# Altium project PowerDistribution.PrjPcb (part 2 of 6)

## Sheet Power Distribution - Power Path.SchDoc: PowerPath Controller
size Letter; Organization: Midnight Sun Solar Rayce Car Team; Address1: University of Waterloo; Address2: 200 University Ave W; Address3: Waterloo, ON, Canada; Address4: N2L 3E9; DocumentNumber: 4; SheetNumber: 4; SheetTotal: 10; Website: www.uwmidsun.com
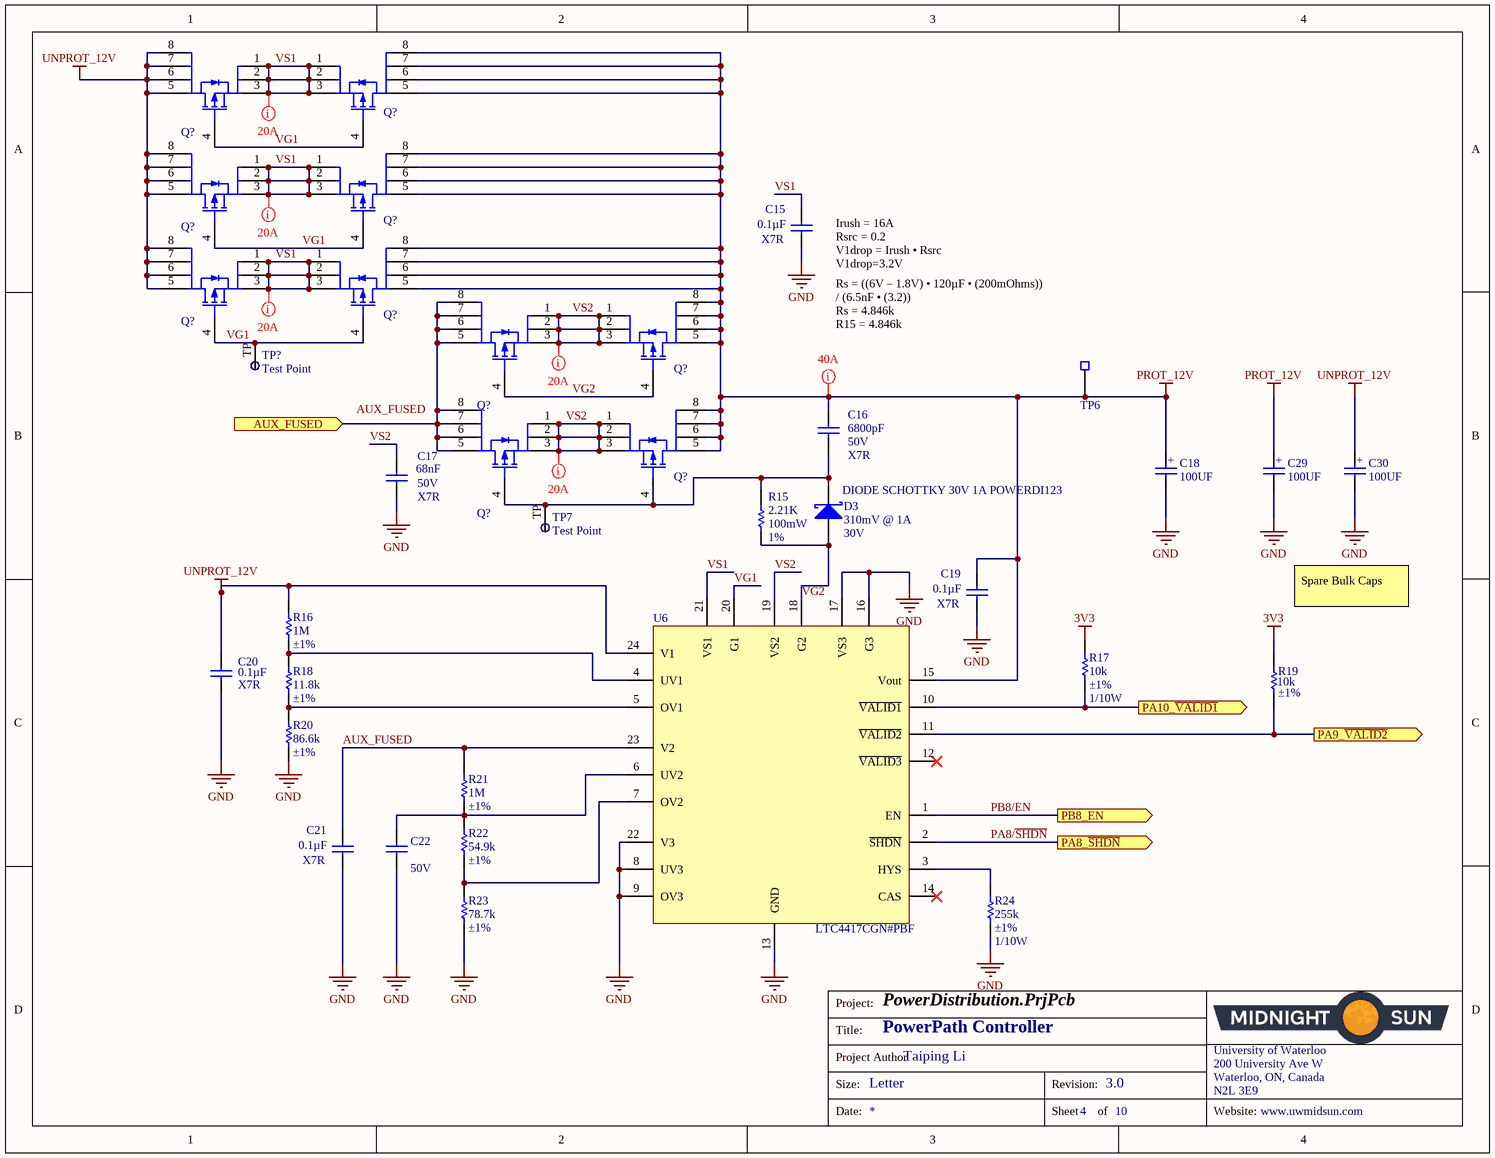
[diagram p3: Power Distribution - Power Path.SchDoc]

### Parts
(Parts that share a designator on the sheet are numbered #1, #2 ... from top to bottom, then left to right.)
C15  Capacitance: 0.1µF  Temperature Coefficient: X7R  [CAP, 0603]  (hidden comment: CAP CER 0.1UF 50V 10% X7R 0603)
C16  Capacitance: 6800pF  Voltage: 50V  Temperature Coefficient: X7R  [CAP, 0603]  (hidden comment: CAP CER 6800pF 50V 10% X7R 0603)
C17  68nF  Voltage Rating: 50V  Dielectric: X7R  [CAP, 0603]
C18  100UF  [CAP ALUM 6.3MM RADIAL SMD]
C19  Capacitance: 0.1µF  Temperature Coefficient: X7R  [CAP, 0603]  (hidden comment: CAP CER 0.1UF 50V 10% X7R 0603)
C20  Capacitance: 0.1µF  Temperature Coefficient: X7R  [CAP, 0603]  (hidden comment: CAP CER 0.1UF 50V 10% X7R 0603)
C21  Capacitance: 0.1µF  Temperature Coefficient: X7R  [CAP, 0603]  (hidden comment: CAP CER 0.1UF 50V 10% X7R 0603)
C22  Voltage - Rated: 50V  [CAP, 0603]  (hidden comment: CAP CER 0.022UF 50V 10% X7R 0603)
C29  100UF  [CAP ALUM 6.3MM RADIAL SMD]  (no BOM)
C30  100UF  [CAP ALUM 6.3MM RADIAL SMD]  (no BOM)
D3  DIODE SCHOTTKY 30V 1A POWERDI123  Voltage - Forward (Vf) (Max) @ If: 310mV @ 1A  Voltage - DC Reverse (Vr) (Max): 30V  [DIODE SCHOTTKY 30V 1A POWERDI123]
Q?#1  MOSFET P-CH PWR56 40V 4.9 MOHM  [PMOS PWR56 40V 4.9 MOHM]  (value not drawn)
Q?#2  MOSFET P-CH PWR56 40V 4.9 MOHM  [PMOS PWR56 40V 4.9 MOHM]  (value not drawn)
Q?#3  MOSFET P-CH PWR56 40V 4.9 MOHM  [PMOS PWR56 40V 4.9 MOHM]  (value not drawn)
Q?#4  MOSFET P-CH PWR56 40V 4.9 MOHM  [PMOS PWR56 40V 4.9 MOHM]  (value not drawn)
Q?#5  MOSFET P-CH PWR56 40V 4.9 MOHM  [PMOS PWR56 40V 4.9 MOHM]  (value not drawn)
Q?#6  MOSFET P-CH PWR56 40V 4.9 MOHM  [PMOS PWR56 40V 4.9 MOHM]  (value not drawn)
Q?#7  MOSFET P-CH PWR56 40V 4.9 MOHM  [PMOS PWR56 40V 4.9 MOHM]  (value not drawn)
Q?#8  MOSFET P-CH PWR56 40V 4.9 MOHM  [PMOS PWR56 40V 4.9 MOHM]  (value not drawn)
Q?#9  MOSFET P-CH PWR56 40V 4.9 MOHM  [PMOS PWR56 40V 4.9 MOHM]  (value not drawn)
Q?#10  MOSFET P-CH PWR56 40V 4.9 MOHM  [PMOS PWR56 40V 4.9 MOHM]  (value not drawn)
R15  2.21K  Tolerance: 1%  Max Power Dissipation: 100mW  [RES, 0603]
R16  Resistance (Ohms): 1M  Tolerance: ±1%  [RES, 0603]  (hidden comment: RES 1M OHM 1% 1/10W 0603)
R17  Resistance: 10k  Tolerance: ±1%  Power: 1/10W  [RES, 0603]  (hidden comment: RES 10K OHM 1% 1/10W 0603)
R18  Resistance (Ohms): 11.8k  Tolerance: ±1%  [RES, 0603]  (hidden comment: RES 11.8K OHM 1% 1/10W 0603)
R19  Resistance: 10k  Tolerance: ±1%  [RES, 0603]  (hidden comment: RES 10K OHM 1% 1/10W 0603)
R20  Resistance (Ohms): 86.6k  Tolerance: ±1%  [RES, 0603]  (hidden comment: RES 86.6K OHM 1% 1/10W 0603)
R21  Resistance (Ohms): 1M  Tolerance: ±1%  [RES, 0603]  (hidden comment: RES 1M OHM 1% 1/10W 0603)
R22  Resistance (Ohms): 54.9k  Tolerance: ±1%  [RES, 0603]  (hidden comment: RES 54.9K OHM 1% 1/10W 0603)
R23  Resistance (Ohms): 78.7k  Tolerance: ±1%  [RES, 0603]  (hidden comment: RES 78.7K OHM 1% 1/10W 0603)
R24  Resistance (Ohms): 255k  Tolerance: ±1%  Power (Watts): 1/10W  [RES, 0603]  (hidden comment: RES 255K OHM 1% 1/10W 0603)
TP6  Test Point 0603 SMD  [TEST POINT 0603 SMD]  (value not drawn)
TP7  Test Point  [Test Point]  (no BOM)
TP?#1  Test Point  [Test Point]  (no BOM)
U6  Manufacturer Part Number 1: LTC4417CGN#PBF  [IC OR CTRLR SRC SELECT 24SSOP]  (hidden comment: IC OR CONTROLLER SOURCE SELECT 24SSOP)

### Ports
AUX_FUSED (in), PA8_~{SHDN} (out), PA9_~{VALID2} (out), PA10_~{VALID1} (out), PB8_EN (out)

### Nets
3V3: R17.1 R19.1
GND: C15.2 C17.2 C18.2 C19.2 C20.2 C21.2 C22.2 C29.2 C30.2 R20.2 R23.2 R24.2 U6.8(UV3) U6.9(OV3) U6.13(GND) U6.16(G3) U6.17(VS3) U6.22(V3)
PROT_12V: C16.1 C18.1 C19.1 C29.1 Q?#2.5(D) Q?#2.6(D) Q?#2.7(D) Q?#2.8(D) Q?#4.5(D) Q?#4.6(D) Q?#4.7(D) Q?#4.8(D) Q?#6.5(D) Q?#6.6(D) Q?#6.7(D) Q?#6.8(D) Q?#8.5(D) Q?#8.6(D) Q?#8.7(D) Q?#8.8(D) Q?#10.5(D) Q?#10.6(D) Q?#10.7(D) Q?#10.8(D) TP6.1 U6.15(Vout)
UNPROT_12V: C20.1 C30.1 Q?#1.5(D) Q?#1.6(D) Q?#1.7(D) Q?#1.8(D) Q?#3.5(D) Q?#3.6(D) Q?#3.7(D) Q?#3.8(D) Q?#5.5(D) Q?#5.6(D) Q?#5.7(D) Q?#5.8(D) R16.1 U6.24(V1)
AUX_FUSED: C21.1 R21.1 U6.23(V2)
PA8/~{SHDN}: U6.2(~{SHDN}) ; port PA8_~{SHDN}
PB8/EN: U6.1(EN) ; port PB8_EN
VG1: Q?#1.4(G) Q?#2.4(G) Q?#3.4(G) Q?#4.4(G) Q?#5.4(G) Q?#6.4(G) TP?#1.TP U6.20(G1)
VG2: D3.1(A) Q?#7.4(G) Q?#8.4(G) R15.2 U6.18(G2)
VS1: C15.1 Q?#1.1(S) Q?#1.2(S) Q?#1.3(S) Q?#2.1(S) Q?#2.2(S) Q?#2.3(S) Q?#3.1(S) Q?#3.2(S) Q?#3.3(S) Q?#4.1(S) Q?#4.2(S) Q?#4.3(S) Q?#5.1(S) Q?#5.2(S) Q?#5.3(S) Q?#6.1(S) Q?#6.2(S) Q?#6.3(S) U6.21(VS1)
VS2: C17.1 Q?#7.1(S) Q?#7.2(S) Q?#7.3(S) Q?#8.1(S) Q?#8.2(S) Q?#8.3(S) Q?#9.1(S) Q?#9.2(S) Q?#9.3(S) Q?#10.1(S) Q?#10.2(S) Q?#10.3(S) U6.19(VS2)
NetC16_2: C16.2 D3.2(K) Q?#9.4(G) Q?#10.4(G) R15.1 TP7.TP
NetC22_1: C22.1 R21.2 R22.1 U6.6(UV2)
NetQ?#7_5: Q?#7.5(D) Q?#7.6(D) Q?#7.7(D) Q?#7.8(D) Q?#9.5(D) Q?#9.6(D) Q?#9.7(D) Q?#9.8(D) ; port AUX_FUSED
NetR16_2: R16.2 R18.1 U6.4(UV1)
NetR17_2: R17.2 U6.10(~{VALID1}) ; port PA10_~{VALID1}
NetR18_2: R18.2 R20.1 U6.5(OV1)
NetR19_2: R19.2 U6.11(~{VALID2}) ; port PA9_~{VALID2}
NetR22_2: R22.2 R23.1 U6.7(OV2)
NetR24_1: R24.1 U6.3(HYS)

Not connected (* = marked no-connect by the designer): U6 12(~{VALID3})* 14(CAS)*

### Layout directives
net class HighCurrent; rule Power Plane Connect Style [Style - Direct Connect]; rule Polygon Connect Style [Style - Direct Connect]: PROT_12V, VS1, VS2

### Notes on the sheet
- (near C15) Irush = 16A
  Rsrc = 0.2
  V1drop = Irush • Rsrc V1drop=3.2V
- Rs = ((6V – 1.8V) • 120µF • (200mOhms)) / (6.5nF • (3.2))
  Rs = 4.846k
  R15 = 4.846k
- Spare Bulk Caps
- Labels drawn without touching a wire or pin: AUX_FUSED
- Project:
- Title:
- Size:
- Project Author
- Letter
- Revision:
- University of Waterloo
- 200 University Ave W
- Waterloo, ON, Canada
- N2L 3E9
- Date:
- Sheet
- of
- Website:
- (in symbol CAP ALUM 100UF 20% 35V SMD) +

### Library data of the parts
C15 C19-C21 = CAP CER 0.1UF 50V 10% X7R 0603: 0.10µF ±10% 50V Ceramic Capacitor X7R 0603 (1608 Metric); Manufacturer 1: AVX Corporation; Manufacturer Part Number 1: 06035C104KAT2A; Supplier 1: Digi-Key; Supplier Part Number 1: 478-5052-1-ND; Packaging: Cut Tape (CT); Part Status: Active; Operating Temperature: -55°C ~ 125°C; Ratings: -; Mounting Type: Surface Mount, MLCC; Package / Case: 0603 (1608 Metric); Size / Dimension: 0.063" L x 0.032" W (1.60mm x 0.81mm); Height - Seated (Max): -; Thickness (Max): 0.035" (0.90mm); Lead Spacing: -; Lead Style: -; ComponentLink1URL: http://datasheets.avx.com/X7RDielectric.pdf; ComponentLink1Description: http://datasheets.avx.com/X7RDielectric.pdf; Tolerance: ±10%; Voltage: 50V
C16 = CAP CER 6800pF 50V 10% X7R 0603: 6800pF ±10% 50V Ceramic Capacitor X7R 0603 (1608 Metric); Manufacturer 1: Samsung Electro-Mechanics America, Inc.; Manufacturer Part Number 1: CL10B682KB8SFNC; Supplier 1: Digi-Key; Supplier Part Number 1: 1276-2103-1-ND; Packaging: Cut Tape (CT); Part Status: Active; Operating Temperature: -55°C ~ 125°C; Ratings: -; Mounting Type: Surface Mount, MLCC; Package / Case: 0603 (1608 Metric); Size / Dimension: 0.063" L x 0.031" W (1.60mm x 0.80mm); Height - Seated (Max): -; Thickness (Max): 0.035" (0.90mm); Lead Spacing: -; Lead Style: -; ComponentLink1URL: http://www.samsungsem.com/kr/support/product-search/mlcc/CL10B682KB8SFNC.jsp; ComponentLink1Description: http://www.samsungsem.com/kr/support/product-search/mlcc/CL10B682KB8SFNC.jsp; Tolerance: ±10%
C17 = CAP CER 0.068UF 10% 50V X7R 0603: 0.068µF 50V Ceramic Capacitor X7R 0603 (1608 Metric) 0.063" L x 0.032" W (1.60mm x 0.80mm); Manufacturer: Murata; Manufacturer Part Number: GCM188R71H683KA57D; Tolerance: 10%; Supplier 1: Digi-Key; Stock 1: 40000; Pricing 1: 1=0.16, 10=0.116, 100=0.0547, 500=0.03832, 1000=0.03172 (USD); Mount: Surface Mount; Case/Package: 0603; Case Code (Metric): 1608; Case Code (Imperial): 0603; Min Operating Temperature: -55°C; Max Operating Temperature: 125°C; Packaging: Tape and Reel; Capacitance: 68nF; Package Quantity: 4000; Voltage Rating (DC): 50V; Termination: SMD/SMT; Length: 1.6mm; Height: 0.8mm; Width: 0.031inch; Thickness: 0.035inch; Depth: 0.8mm; Radiation Hardening: No; ComponentLink1URL: https://datasheet.ciiva.com/29542/s0717e-29542427.pdf; ComponentLink1Description: https://datasheet.ciiva.com/29542/s0717e-29542427.pdf; ComponentLink2URL: https://datasheet.ciiva.com/29542/s0717e-29542428.pdf; ComponentLink2Description: https://datasheet.ciiva.com/29542/s0717e-29542428.pdf; ComponentLink3URL: https://datasheet.ciiva.com/29542/s0717e-29542429.pdf; ComponentLink3Description: https://datasheet.ciiva.com/29542/s0717e-29542429.pdf; Supplier Part Number 1: 490-8027-1-ND
C18 C29 C30 = CAP ALUM 100UF 20% 35V SMD: 100µF 35V Aluminum Electrolytic Capacitors Radial, Can - SMD 2000 Hrs @ 85°C; Manufacturer 1: Panasonic; Manufacturer Part Number 1: EEE-1VA101XP; Description 1: Cap Aluminum Lytic 100uF 35V 20% (6.3 X 7.7mm) SMD 132mA 2000h 85C Automotive T/R; Tolerance: 20%; Ripple Current: 132mA; Polarity: Polar; Life (Hours): 2000Hour; Leakage Current: 3uA; Supplier 1: Digi-Key; Supplier Part Number 1: PCE3951CT-ND; Stock 1: 170823; Pricing 1: 1=0.44, 10=0.304, 100=0.1822 (USD); Mount: Surface Mount,PCB; Case/Package: Radial; Number of Pins: 8; Contact Plating: Tin; Min Operating Temperature: -40°C; Max Operating Temperature: 85°C; Capacitance: 100uF; Voltage Rating: 35V; Packaging: Tape and Reel; Package Quantity: 900; Ripple Current (AC): 132mA; Voltage Rating (DC): 35V; Termination: SMD/SMT; Voltage: 35V; Diameter: 6.3mm; Length: 8mm; Height: 7.7mm; Height - Seated (Max): 0.303inch; Radiation Hardening: No; REACH SVHC: No SVHC; Lead Free: Lead Free; ComponentLink1URL: https://datasheet.ciiva.com/46378/aba0000ce2-46378341.pdf; ComponentLink1Description: https://datasheet.ciiva.com/46378/aba0000ce2-46378341.pdf; ComponentLink2URL: https://datasheet.ciiva.com/17535/aba0000ce2-17535510.pdf; ComponentLink2Description: https://datasheet.ciiva.com/17535/aba0000ce2-17535510.pdf; ComponentLink3URL: https://datasheet.ciiva.com/30170/11aba0000ce2-30170103.pdf; ComponentLink3Description: https://datasheet.ciiva.com/30170/11aba0000ce2-30170103.pdf; ComponentLink4URL: https://datasheet.ciiva.com/31414/aba0000ce2-31414696.pdf; ComponentLink4Description: https://datasheet.ciiva.com/31414/aba0000ce2-31414696.pdf; ComponentLink5URL: https://datasheet.ciiva.com/24068/aba0000ce2-40801-24068089.pdf; ComponentLink5Description: https://datasheet.ciiva.com/24068/aba0000ce2-40801-24068089.pdf; ComponentLink6URL: https://datasheet.ciiva.com/14591/70255710-14591771.pdf; ComponentLink6Description: https://datasheet.ciiva.com/14591/70255710-14591771.pdf; ComponentLink7URL: https://datasheet.ciiva.com/14600/70255710-14600731.pdf; ComponentLink7Description: https://datasheet.ciiva.com/14600/70255710-14600731.pdf; ComponentLink8URL: https://datasheet.ciiva.com/46374/aba0000ce2-46374427.pdf; ComponentLink8Description: https://datasheet.ciiva.com/46374/aba0000ce2-46374427.pdf; ComponentLink9URL: https://datasheet.ciiva.com/11673/aba0000ce2-11673887.pdf; ComponentLink9Description: https://datasheet.ciiva.com/11673/aba0000ce2-11673887.pdf
C22 = CAP CER 0.022UF 50V 10% X7R 0603: 0.022µF ±10% 50V Ceramic Capacitor X7R 0603 (1608 Metric); Manufacturer 1: Murata Electronics North America; Manufacturer Part Number 1: GRM188R71H223KA01D; Description 1: CAP CER 0.022UF 50V X7R 0603; Supplier 1: Digi-Key; Supplier Part Number 1: 490-1517-1-ND; RoHS: RoHS Compliant; Category: Capacitors; Stock 1: 612330; Pricing 1: 1=0.15, 10=0.111, 100=0.0499, 500=0.03564, 1000=0.02801 (CAD); Packaging: Cut Tape (CT); Part Status: Active; Tolerance: ±10%; Temperature Coefficient: X7R; Operating Temperature: -55°C ~ 125°C; Features: -; Ratings: -; Applications: General Purpose; Mounting Type: Surface Mount, MLCC; Package / Case: 0603 (1608 Metric); Size / Dimension: 0.063" L x 0.032" W (1.60mm x 0.80mm); Height - Seated (Max): -; Thickness (Max): 0.035" (0.90mm); Lead Spacing: -; Lead Style: -; ComponentLink1URL: http://search.murata.co.jp/Ceramy/image/img/A01X/G101/ENG/GRM188R71H223KA01-01.pdf; ComponentLink1Description: http://search.murata.co.jp/Ceramy/image/img/A01X/G101/ENG/GRM188R71H223KA01-01.pdf
D3 = DIODE SCHOTTKY 30V 1A POWERDI123: Diode Schottky 30V 1A Surface Mount PowerDI™ 123; Manufacturer: Diodes Incorporated; Manufacturer Part Number: DFLS130L-7; Speed: Fast Recovery =< 500ns, > 200mA (Io); Current - Reverse Leakage @ Vr: 1mA @ 30V; Capacitance @ Vr, F: 76pF @ 10V, 1MHz; Supplier 1: Digi-Key; RoHS: RoHS Compliant; Category: Discrete Semiconductor Products; Stock 1: 68200; Packaging: Cut Tape (CT); Part Status: Active; Diode Type: Schottky; Mounting Type: Surface Mount; Package / Case: POWERDI®123; Supplier Device Package: PowerDI™ 123; Operating Temperature - Junction: -40°C ~ 125°C; ComponentLink1URL: https://www.diodes.com/assets/Datasheets/ds30492.pdf; ComponentLink1Description: https://www.diodes.com/assets/Datasheets/ds30492.pdf; Supplier Part Number 1: DFLS130LDICT-ND; Pricing 1: 1=0.7, 10=0.599, 100=0.447, 500=0.35126, 1000=0.27142 (CAD); Current - Average Rectified (Io): 1A
Q?#1-Q?#10 = MOSFET P-CH PWR56 40V 4.9 MOHM: P-Channel 16V 2.5A (Ta) 650mW (Ta) Surface Mount X2-DFN2015-3; Current - Continuous Drain (Id) @ 25°C: 80A (Tc); Drive Voltage (Max Rds On,  Min Rds On): 4.5V, 10V; Vgs(th) (Max) @ Id: 3V @ 250µA; Gate Charge (Qg) (Max) @ Vgs: 107nC @ 10V; Input Capacitance (Ciss) (Max) @ Vds: 4840pF @ 20V; Power Dissipation (Max): 214W (Tj); Rds On (Max) @ Id, Vgs: 4.9mOhm @ 80A, 10V; Packaging: Cut Tape (CT); Part Status: Active; FET Type: P-Channel; Technology: MOSFET (Metal Oxide); Drain to Source Voltage (Vdss): 40V; Vgs (Max): ±16V; FET Feature: -; Operating Temperature: -55°C ~ 175°C (TJ); Mounting Type: Surface Mount; Supplier Device Package: FDWS9508L-F085OSCT-ND; Package / Case: 8-PowerTDFN; ComponentLink1URL: https://www.onsemi.com/pub/Collateral/FDWS9508L-F085-D.PDF; ComponentLink1Description: https://www.onsemi.com/pub/Collateral/FDWS9508L-F085-D.PDF; Supplier 1: Digi-Key; Supplier Part Number 1: FDWS9508L-F085OSCT-ND
R15 = RES 2.21K OHM 1% 1/10W 0603: 2.21 kOhms ±1% 0.1W, 1/10W Chip Resistor 0603 (1608 Metric) Automotive AEC-Q200, Moisture Resistant Thick Film; Manufacturer: Yageo; Manufacturer Part Number: AC0603FR-072K21L; Voltage Rating: 50V; Resistance: 2.21kR; Temperature Coefficient: 100ppm/°C; Working Voltage: 75V; Supplier 1: Digi-Key; Stock 1: 11020; Pricing 1: 1=0.1, 10=0.029, 100=0.0117, 1000=0.00527, 2500=0.00458 (USD); Case/Package: 0603; Weight: 7.1E-05oz; Case Code (Imperial): 0603; Case Code (Metric): 1608; Min Operating Temperature: -55°C; Max Operating Temperature: 155°C; Power Rating: 100mW; Packaging: Tape and Reel; Composition: Thick Film; Termination: SMD/SMT; Number of Terminations: 2; Length: 0.063inch; Height: 0.022inch; Width: 0.8mm; Lead Free: Lead Free; ComponentLink1URL: https://datasheet.ciiva.com/12576/pyu-ac-51-rohs-l-2-12576458.pdf; ComponentLink1Description: https://datasheet.ciiva.com/12576/pyu-ac-51-rohs-l-2-12576458.pdf; Supplier Part Number 1: YAG3586CT-ND
R16 R21 = RES 1M OHM 1% 1/10W 0603: 1M Ohm ±1% 0.1W, 1/10W Chip Resistor 0603 (1608 Metric) Moisture Resistant Thick Film; Manufacturer 1: Yageo; Manufacturer Part Number 1: RC0603FR-071ML; Description 1: RES SMD 1M OHM 1% 1/10W 0603; Temperature Coefficient: ±100ppm/°C; Supplier 1: Digi-Key; Supplier Part Number 1: 311-1.00MHRCT-ND; RoHS: RoHS Compliant; Category: Resistors; Stock 1: 2336711; Pricing 1: 1=0.16, 10=0.022, 100=0.0089, 1000=0.00402, 2500=0.00349 (CAD); Packaging: Cut Tape (CT); Part Status: Active; Composition: Thick Film; Features: Moisture Resistant; Operating Temperature: -55°C ~ 155°C; Package / Case: 0603 (1608 Metric); Supplier Device Package: 0603; Size / Dimension: 0.063" L x 0.031" W (1.60mm x 0.80mm); Height - Seated (Max): 0.022" (0.55mm); Failure Rate: -; ComponentLink1URL: http://www.yageo.com/documents/recent/PYu-RC_Group_51_RoHS_L_7.pdf; ComponentLink1Description: http://www.yageo.com/documents/recent/PYu-RC_Group_51_RoHS_L_7.pdf
R17 R19 = RES 10K OHM 1% 1/10W 0603: RES SMD 10K OHM 1% 1/10W 0603; Manufacturer 1: Yageo; Manufacturer Part Number 1: RC0603FR-0710KL; Temperature Coefficient: ±100ppm/°C; Supplier 1: Digi-Key; Supplier Part Number 1: 311-10.0KHRCT-ND; Packaging: Cut Tape (CT); Part Status: Active; Composition: Thick Film; Operating Temperature: -55°C ~ 155°C; Package / Case: 0603 (1608 Metric); Supplier Device Package: 0603; Size / Dimension: 0.063" L x 0.031" W (1.60mm x 0.80mm); Height - Seated (Max): 0.022" (0.55mm); Failure Rate: -; ComponentLink1URL: http://www.yageo.com/documents/recent/PYu-RC_Group_51_RoHS_L_7.pdf; ComponentLink1Description: http://www.yageo.com/documents/recent/PYu-RC_Group_51_RoHS_L_7.pdf
R18 = RES 11.8K OHM 1% 1/10W 0603: 11.8k Ohm ±1% 0.1W, 1/10W Chip Resistor 0603 (1608 Metric) Moisture Resistant Thick Film; Manufacturer: Yageo; Manufacturer Part Number: RC0603FR-0711K8L; Temperature Coefficient: ±100ppm/°C; Supplier 1: Digi-Key; RoHS: RoHS Compliant; Category: Resistors; Stock 1: 203280; Pricing 1: 1=0.16, 10=0.022, 100=0.0089, 1000=0.00402, 2500=0.00349 (CAD); Packaging: Cut Tape (CT); Part Status: Active; Power (Watts): 1/10W; Composition: Thick Film; Features: Moisture Resistant; Operating Temperature: -55°C ~ 155°C; Package / Case: 0603 (1608 Metric); Supplier Device Package: 0603; Size / Dimension: 0.063" L x 0.031" W (1.60mm x 0.80mm); Height - Seated (Max): 0.022" (0.55mm); Failure Rate: -; ComponentLink1URL: http://www.yageo.com/documents/recent/PYu-RC_Group_51_RoHS_L_7.pdf; ComponentLink1Description: http://www.yageo.com/documents/recent/PYu-RC_Group_51_RoHS_L_7.pdf; Supplier Part Number 1: 311-11.8KHRCT-ND
R20 = RES 86.6K OHM 1% 1/10W 0603: 86.6k Ohm ±1% 0.1W, 1/10W Chip Resistor 0603 (1608 Metric) Automotive AEC-Q200 Thick Film; Manufacturer: Panasonic Electronic Components; Manufacturer Part Number: ERJ-3EKF8662V; Temperature Coefficient: ±100ppm/°C; Supplier 1: Digi-Key; RoHS: RoHS Compliant; Category: Resistors; Stock 1: 64161; Pricing 1: 1=0.16, 10=0.031, 100=0.0127, 1000=0.00567, 2500=0.00492 (CAD); Packaging: Cut Tape (CT); Part Status: Active; Power (Watts): 1/10W; Composition: Thick Film; Features: Automotive AEC-Q200; Operating Temperature: -55°C ~ 155°C; Package / Case: 0603 (1608 Metric); Supplier Device Package: 0603; Size / Dimension: 0.063" L x 0.031" W (1.60mm x 0.80mm); Height - Seated (Max): 0.022" (0.55mm); Failure Rate: -; ComponentLink1URL: https://industrial.panasonic.com/cdbs/www-data/pdf/RDA0000/AOA0000C298.pdf; ComponentLink1Description: https://industrial.panasonic.com/cdbs/www-data/pdf/RDA0000/AOA0000C298.pdf; Supplier Part Number 1: P86.6KHCT-ND
R22 = RES 54.9K OHM 1% 1/10W 0603: 54.9k Ohm ±1% 0.1W, 1/10W Chip Resistor 0603 (1608 Metric) Automotive AEC-Q200 Thick Film; Manufacturer: Panasonic Electronic Components; Manufacturer Part Number: ERJ-3EKF5492V; Temperature Coefficient: ±100ppm/°C; Supplier 1: Digi-Key; RoHS: RoHS Compliant; Category: Resistors; Stock 1: 74038; Pricing 1: 1=0.16, 10=0.031, 100=0.0127, 1000=0.00567, 2500=0.00492 (CAD); Packaging: Cut Tape (CT); Part Status: Active; Power (Watts): 1/10W; Composition: Thick Film; Features: Automotive AEC-Q200; Operating Temperature: -55°C ~ 155°C; Package / Case: 0603 (1608 Metric); Supplier Device Package: 0603; Size / Dimension: 0.063" L x 0.031" W (1.60mm x 0.80mm); Height - Seated (Max): 0.022" (0.55mm); Failure Rate: -; ComponentLink1URL: https://industrial.panasonic.com/cdbs/www-data/pdf/RDA0000/AOA0000C298.pdf; ComponentLink1Description: https://industrial.panasonic.com/cdbs/www-data/pdf/RDA0000/AOA0000C298.pdf; Supplier Part Number 1: P54.9KHCT-ND
R23 = RES 78.7K OHM 1% 1/10W 0603: 78.7k Ohm ±1% 0.1W, 1/10W Chip Resistor 0603 (1608 Metric) Automotive AEC-Q200 Thick Film; Manufacturer: Panasonic Electronic Components; Manufacturer Part Number: ERJ-3EKF7872V; Temperature Coefficient: ±100ppm/°C; Supplier 1: Digi-Key; RoHS: RoHS Compliant; Category: Resistors; Packaging: Cut Tape (CT); Part Status: Active; Power (Watts): 1/10W; Composition: Thick Film; Features: Automotive AEC-Q200; Operating Temperature: -55°C ~ 155°C; Package / Case: 0603 (1608 Metric); Supplier Device Package: 0603; Size / Dimension: 0.063" L x 0.031" W (1.60mm x 0.80mm); Height - Seated (Max): 0.022" (0.55mm); Failure Rate: -; ComponentLink1URL: https://industrial.panasonic.com/cdbs/www-data/pdf/RDA0000/AOA0000C298.pdf; ComponentLink1Description: https://industrial.panasonic.com/cdbs/www-data/pdf/RDA0000/AOA0000C298.pdf; Supplier Part Number 1: P78.7KHCT-ND
R24 = RES 255K OHM 1% 1/10W 0603: 255k Ohm ±1% 0.1W, 1/10W Chip Resistor 0603 (1608 Metric) Moisture Resistant Thick Film; Manufacturer 1: Yageo; Manufacturer Part Number 1: RC0603FR-07255KL; Description 1: RES SMD 255K OHM 1% 1/10W 0603; Temperature Coefficient: ±100ppm/°C; Supplier 1: Digi-Key; Supplier Part Number 1: 311-255KHRCT-ND; RoHS: RoHS Compliant; Category: Resistors; Stock 1: 106564; Pricing 1: 1=0.16, 10=0.022, 100=0.0089, 1000=0.00402, 2500=0.00349 (CAD); Packaging: Cut Tape (CT); Part Status: Active; Composition: Thick Film; Features: Moisture Resistant; Operating Temperature: -55°C ~ 155°C; Package / Case: 0603 (1608 Metric); Supplier Device Package: 0603; Size / Dimension: 0.063" L x 0.031" W (1.60mm x 0.80mm); Height - Seated (Max): 0.022" (0.55mm); Failure Rate: -; ComponentLink1URL: http://www.yageo.com/documents/recent/PYu-RC_Group_51_RoHS_L_7.pdf; ComponentLink1Description: http://www.yageo.com/documents/recent/PYu-RC_Group_51_RoHS_L_7.pdf
TP6 = Test Point 0603 SMD: Manufacturer 1: TE Connectivity; Manufacturer Part Number 1: 1625854-3; Description 1: Thick Film Resistors - SMD 2000; Resistance: 0mR; Supplier 1: Digi-Key; Supplier Part Number 1: A106145CT-ND; Stock 1: 212628; Pricing 1: 1=0.22, 10=0.211, 25=0.18, 50=0.1574, 100=0.1462, 250=0.12932, 500=0.12368, 1000=0.1012 (USD); Mount: Surface Mount; Case/Package: 0603; Colour: Natural; Case Code (Imperial): 0603; Case Code (Metric): 1608; Min Operating Temperature: -55°C; Max Operating Temperature: 125°C; Packaging: Tape and Reel; Termination: SMD/SMT; Package Quantity: 2000; Military Standard: Not; Length: 1.6mm; Height: 1.15mm; Width: 0.8mm; Depth: 0.8mm; Radiation Hardening: No; ComponentLink1URL: https://datasheet.ciiva.com/30100/1773266-a-30100967.pdf; ComponentLink1Description: https://datasheet.ciiva.com/30100/1773266-a-30100967.pdf; ComponentLink2URL: https://datasheet.ciiva.com/8914/eng-ds-1773266-a-8914634.pdf; ComponentLink2Description: https://datasheet.ciiva.com/8914/eng-ds-1773266-a-8914634.pdf; ComponentLink3URL: https://datasheet.ciiva.com/6439/eng-ds-1773266-a-6439163.pdf; ComponentLink3Description: https://datasheet.ciiva.com/6439/eng-ds-1773266-a-6439163.pdf; ComponentLink4URL: https://datasheet.ciiva.com/6439/eng-ds-1773266-a-6439164.pdf; ComponentLink4Description: https://datasheet.ciiva.com/6439/eng-ds-1773266-a-6439164.pdf; ComponentLink5URL: https://datasheet.ciiva.com/6439/eng-ds-1773266-a-6439165.pdf; ComponentLink5Description: https://datasheet.ciiva.com/6439/eng-ds-1773266-a-6439165.pdf
U6 = IC OR CONTROLLER SOURCE SELECT 24SSOP: OR Controller Source Selector Switch P-Channel 3:1 24-SSOP; Manufacturer 1: Linear Technology; Internal Switch(s): No; Current - Supply: 28µA; Voltage - Supply: 2.5 V ~ 36 V; Supplier 1: Digi-Key; Supplier Part Number 1: LTC4417CGN#PBF-ND; Packaging: Tube; Part Status: Active; Type: Source Selector Switch; FET Type: P-Channel; Ratio - Input:Output: 3:1; Current - Output (Max): -; Operating Temperature: 0°C ~ 70°C; Mounting Type: Surface Mount; Package / Case: 24-SSOP (0.154", 3.90mm Width); Supplier Device Package: 24-SSOP; ComponentLink1URL: http://www.linear.com/docs/42408; ComponentLink1Description: http://www.linear.com/docs/42408

## Sheet Power Distribution - Aux Battery.SchDoc: Aux Battery Input
size Letter; Organization: Midnight Sun Solar Rayce Car Team; Address1: University of Waterloo; Address2: 200 University Ave W; Address3: Waterloo, ON, Canada; Address4: N2L 3E9; DocumentNumber: 3; SheetNumber: 3; SheetTotal: 10; Website: www.uwmidsun.com
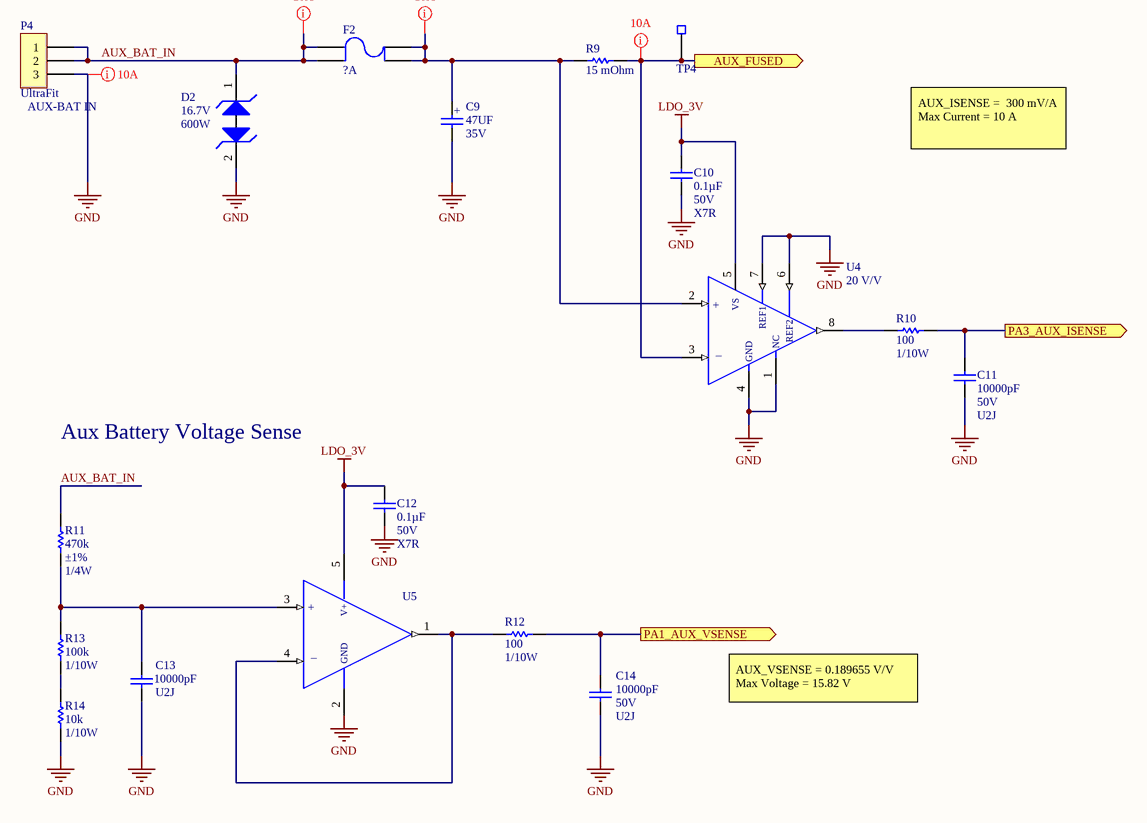
[diagram p4: Power Distribution - Aux Battery.SchDoc]

### Parts
C9  47UF  Voltage Rating: 35V  [CAP ALUM 6.3MM RADIAL SMD]
C10  Capacitance: 0.1µF  Voltage: 50V  Temperature Coefficient: X7R  [CAP, 0603]  (hidden comment: CAP CER 0.1UF 50V 10% X7R 0603)
C11  Capacitance: 10000pF  Voltage: 50V  Temperature Coefficient: U2J  [CAP, 0603]  (hidden comment: CAP CER 10nF 50V 5% X7R 0603)
C12  Capacitance: 0.1µF  Voltage: 50V  Temperature Coefficient: X7R  [CAP, 0603]  (hidden comment: CAP CER 0.1UF 50V 10% X7R 0603)
C13  Capacitance: 10000pF  Temperature Coefficient: U2J  [CAP, 0603]  (hidden comment: CAP CER 10nF 50V 5% X7R 0603)
C14  Capacitance: 10000pF  Voltage: 50V  Temperature Coefficient: U2J  [CAP, 0603]  (hidden comment: CAP CER 10nF 50V 5% X7R 0603)
D2  Voltage - Breakdown (Min): 16.7V  Power - Peak Pulse: 600W  [DO-214AA Diode]  (hidden comment: DIODE TVS 15VWM 24.4VC DO-214AA (SMB))
F2  ?A  [FUSE ATO/ATC FUSE HOLDER]
P4  Series: UltraFit  (hidden comment: CONN 3POS ULTRA-FIT 0.138")
R9  15 mOhm  [RES 2818]
R10  Resistance: 100  Power: 1/10W  [RES, 0603]  (hidden comment: RES 100 OHM 1% 1/10W 0603)
R11  Resistance: 470k  Tolerance: ±1%  Power: 1/4W  [RES, 0603]  (hidden comment: RES 470K OHM 1% 1/4W 0603)
R12  Resistance: 100  Power: 1/10W  [RES, 0603]  (hidden comment: RES 100 OHM 1% 1/10W 0603)
R13  Resistance: 100k  Power: 1/10W  [RES, 0603]  (hidden comment: RES 100K OHM 5% 1/8W 0603)
R14  Resistance: 10k  Power: 1/10W  [RES, 0603]  (hidden comment: RES 10K OHM 1% 1/10W 0603)
TP4  Test Point 0603 SMD  [TEST POINT 0603 SMD]  (value not drawn)
U4  20 V/V  [IC CURRENT AMPLIFIER INA240 TSSOP-8]
U5  IC OP AMP GEN PURPOSE RR 10MHZ SOT-23-5  [IC OP AMP GP RR 10MHZ SOT-23-5]  (value not drawn)

### Ports
AUX_FUSED (out), PA1_AUX_VSENSE (out), PA3_AUX_ISENSE (out)

### Nets
GND: C9.2 C10.2 C11.2 C12.2 C13.2 C14.2 D2.2(Cathode2) P4.3 R14.2 U4.1(NC) U4.4(GND) U4.6(REF2) U4.7(REF1) U5.2(VSS)
LDO_3V: C10.1 C12.1 U4.5(VS) U5.5(VDD)
AUX_BAT_IN: D2.1(Cathode1) F2.1 F2.3 P4.1 P4.2 R11.1
NetC9_1: C9.1 F2.2 F2.4 R9.1 U4.2(+IN)
NetC11_1: C11.1 R10.2 ; port PA3_AUX_ISENSE
NetC13_1: C13.1 R11.2 R13.1 U5.3(+IN)
NetC14_1: C14.1 R12.2 ; port PA1_AUX_VSENSE
NetR9_2: R9.2 TP4.1 U4.3(-IN) ; port AUX_FUSED
NetR10_1: R10.1 U4.8(OUTPUT)
NetR12_1: R12.1 U5.1(OUTPUT) U5.4(-IN)
NetR13_2: R13.2 R14.1

### Layout directives
net class HighCurrent; rule Power Plane Connect Style [Style - Direct Connect]; rule Polygon Connect Style [Style - Direct Connect]: AUX_BAT_IN, GND, NetC9_1, NetR9_2

### Notes on the sheet
- (near P4) AUX-BAT IN
- AUX_ISENSE =  300 mV/A
  Max Current = 10 A
- Aux Battery Voltage Sense
- AUX_VSENSE = 0.189655 V/V
  Max Voltage = 15.82 V
- Project:
- Title:
- Size:
- Project Author
- Letter
- Revision:
- University of Waterloo
- 200 University Ave W
- Waterloo, ON, Canada
- N2L 3E9
- Date:
- Sheet
- of
- Website:
- (in symbol CAP ALUM 47UF 20% 35V SMD) +
- (in symbol IC CURRENT AMPLIFIER INA240A1 20V/V 8-TSSOP) +; _
- (in symbol IC OP AMP GEN PURPOSE RR 10MHZ SOT-23-5) V+; +; GND; _

### Library data of the parts
C9 = CAP ALUM 47UF 20% 35V SMD: 47µF 35V Aluminum Electrolytic Capacitors Radial, Can - SMD 1000 Hrs @ 85°C; Manufacturer: Panasonic; Manufacturer Part Number: EEE-1VA470WP; Tolerance: 20%; Ripple Current: 70mA; Life (Hours): 1000Hour; Supplier 1: Digi-Key; Stock 1: 2820; Pricing 1: 1=0.38, 10=0.263, 100=0.1579, 500=0.11846 (USD); Mount: Surface Mount,PCB; Case/Package: Radial; Contact Plating: Tin; Min Operating Temperature: -40°C; Max Operating Temperature: 85°C; Capacitance: 47uF; Voltage Rating (DC): 35V; Packaging: Tape and Reel; Package Quantity: 1; Ripple Current (AC): 70mA; Termination: SMD/SMT; Diameter: 6.3mm; Length: 5.5mm; Height: 5.4mm; Height - Seated (Max): 0.213inch; Radiation Hardening: No; REACH SVHC: Unknown; Lead Free: Lead Free; ComponentLink1URL: https://datasheet.ciiva.com/2983/aba0000ce2-2983926.pdf; ComponentLink1Description: https://datasheet.ciiva.com/2983/aba0000ce2-2983926.pdf; ComponentLink2URL: https://datasheet.ciiva.com/2983/aba0000ce2-2983927.pdf; ComponentLink2Description: https://datasheet.ciiva.com/2983/aba0000ce2-2983927.pdf; ComponentLink3URL: https://datasheet.ciiva.com/14598/70255710-14598937.pdf; ComponentLink3Description: https://datasheet.ciiva.com/14598/70255710-14598937.pdf; ComponentLink4URL: https://datasheet.ciiva.com/15165/getdatasheetpartid-86239-15165868.pdf; ComponentLink4Description: https://datasheet.ciiva.com/15165/getdatasheetpartid-86239-15165868.pdf; ComponentLink5URL: https://datasheet.ciiva.com/16507/aba0000ce2-16507965.pdf; ComponentLink5Description: https://datasheet.ciiva.com/16507/aba0000ce2-16507965.pdf; ComponentLink6URL: https://datasheet.ciiva.com/30206/11aba0000ce2-30206253.pdf; ComponentLink6Description: https://datasheet.ciiva.com/30206/11aba0000ce2-30206253.pdf; Supplier Part Number 1: PCE3961CT-ND
C10 C12 = CAP CER 0.1UF 50V 10% X7R 0603: as C15 on sheet Power Distribution - Power Path; Supplier 1: Digi-Key; Supplier Part Number 1: 478-5052-1-ND; Packaging: Cut Tape (CT); Part Status: Active; Operating Temperature: -55°C ~ 125°C; Ratings: -; Mounting Type: Surface Mount, MLCC; Package / Case: 0603 (1608 Metric); Size / Dimension: 0.063" L x 0.032" W (1.60mm x 0.81mm); Height - Seated (Max): -; Thickness (Max): 0.035" (0.90mm); Lead Spacing: -; Lead Style: -; ComponentLink1URL: http://datasheets.avx.com/X7RDielectric.pdf; ComponentLink1Description: http://datasheets.avx.com/X7RDielectric.pdf; Tolerance: ±10%
C11 C13 C14 = CAP CER 10nF 50V 5% X7R 0603: 10000pF ±5% 50V Ceramic Capacitor U2J 0603 (1608 Metric); Manufacturer 1: KEMET; Manufacturer Part Number 1: C0603C103J5JAC7867; Supplier 1: Digi-Key; Supplier Part Number 1: 399-13384-1-ND; Packaging: Cut Tape (CT); Part Status: Active; Operating Temperature: -55°C ~ 125°C; Ratings: -; Failure Rate: -; Mounting Type: Surface Mount, MLCC; Package / Case: 0603 (1608 Metric); Size / Dimension: 0.063" L x 0.032" W (1.60mm x 0.80mm); Height - Seated (Max): -; Thickness (Max): 0.034" (0.87mm); Lead Spacing: -; Lead Style: -; ComponentLink1URL: http://www.kemet.com/docfinder?Partnumber=C0603C103J5JAC7867; ComponentLink1Description: http://www.kemet.com/docfinder?Partnumber=C0603C103J5JAC7867; Tolerance: ±5%
  C13: Voltage: 50V
D2 = DIODE TVS 15VWM 24.4VC DO-214AA (SMB): TVS DIODE 15VWM 24.4VC SMB; Manufacturer 1: Fairchild/ON Semiconductor; Manufacturer Part Number 1: SMBJ15CA; Type: Zener; Voltage - Reverse Standoff (Typ): 15V; Voltage - Clamping (Max) @ Ipp: 24.4V; Current - Peak Pulse (10/1000µs): 24.6A; Power Line Protection: No; Supplier 1: Digi-Key; Supplier Part Number 1: SMBJ15CAFSCT-ND; RoHS: RoHS Compliant; Description 1: TVS DIODE 15VWM 24.4VC SMB; Category: Circuit Protection; Stock 1: 24965; Pricing 1: 1=0.54, 10=0.444, 100=0.3027, 500=0.22704, 1000=0.17028 (CAD); Packaging: Cut Tape (CT); Part Status: Active; Applications: General Purpose; Capacitance @ Frequency: -; Operating Temperature: -55°C ~ 150°C (TJ); Mounting Type: Surface Mount; Package / Case: DO-214AA, SMB; Supplier Device Package: DO-214AA (SMB); ComponentLink1URL: https://www.fairchildsemi.com/datasheets/SM/SMBJ10CA.pdf; ComponentLink1Description: https://www.fairchildsemi.com/datasheets/SM/SMBJ10CA.pdf
F2 = FUSE ATO FUSE HOLDER: Fuse Block 30A 500V 1 Circuit Blade PCB; Manufacturer 1: Keystone Electronics; Manufacturer Part Number 1: 3557-2; Description 1: FUSE BLOCK BLADE 500V 30A PCB; For Use With/Related Products: ATC, ATO 257, MINI 897; Fuse Size: 0.43" L x 0.15" W x 0.64" H (10.92mm x 3.81mm x 16.25mm); Number of Circuits: 1; Supplier 1: Digi-Key; Supplier Part Number 1: 36-3557-2-ND; RoHS: RoHS Compliant; Category: Circuit Protection; Stock 1: 48838; Pricing 1: 1=1.66, 10=1.442, 50=1.3008, 100=1.2441, 250=1.13096, 500=1.01784, 1000=1.0126, 2500=0.84861, 5000=0.81519 (CAD); Part Status: Active; Fuseholder Type: Block; Fuse Type: Blade; Voltage: 500V; Current Rating: 30A; Mounting Type: PCB; Orientation: Vertical; Termination Style: PC Pin; Contact Material: Brass; Contact Finish: Tin Nickel; ComponentLink1URL: http://www.keyelco.com/product-pdf.cfm?p=296; ComponentLink1Description: http://www.keyelco.com/product-pdf.cfm?p=296
P4 = CONN 3POS ULTRA-FIT 0.138": 3 Positions Header Connector 0.138" (3.50mm) Through Hole Tin; Manufacturer 1: Molex, LLC; Manufacturer Part Number 1: 1722871103; Style: Board to Cable/Wire; Shrouding: Shrouded - 4 Wall; Number of Positions: 3; Number of Positions Loaded: All; Contact Length - Post: 0.126" (3.20mm); Material Flammability Rating: UL94 V-0; Mated Stacking Heights: 26.99mm; Voltage: 400V; Supplier 1: Digi-Key; Supplier Part Number 1: WM11702-ND; Packaging: Tray; Part Status: Active; Connector Type: Header; Contact Type: Male Pin; Pitch - Mating: 0.138" (3.50mm); Number of Rows: 1; Row Spacing - Mating: -; Mounting Type: Through Hole; Termination: Solder; Fastening Type: Latch Holder; Contact Length - Mating: -; Overall Contact Length: -; Insulation Height: 0.465" (11.80mm); Contact Shape: Square; Contact Finish - Mating: Tin; Contact Finish Thickness - Mating: 60µin (1.52µm); Contact Finish - Post: Tin; Contact Material: Copper Alloy; Insulation Material: Liquid Crystal Polymer (LCP); Operating Temperature: -40°C ~ 105°C; Ingress Protection: -; Insulation Color: Black; Current Rating: -; Contact Finish Thickness - Post: 60µin (1.52µm); ComponentLink1URL: http://www.molex.com/pdm_docs/sd/1722871103_sd.pdf; ComponentLink1Description: http://www.molex.com/pdm_docs/sd/1722871103_sd.pdf
R9 = RES 0.015 OHM 1% 7W 2818: 15 mOhms ±1% 7W Chip Resistor Nonstandard Automotive AEC-Q200, Current Sense, Moisture Resistant, Pulse Withstanding Metal Element; ComponentLink1URL: http://www.mouser.com/ds/2/427/wshm2818-469484.pdf; ComponentLink1Description: http://www.mouser.com/ds/2/427/wshm2818-469484.pdf; ComponentLink2URL: http://www.vishay.com/docs/49536/_wshm2818_vmn-pt0284.pdf; ComponentLink2Description: http://www.vishay.com/docs/49536/_wshm2818_vmn-pt0284.pdf; ComponentLink3URL: http://www.vishay.com/docs/30188/wshm2818.pdf; ComponentLink3Description: http://www.vishay.com/docs/30188/wshm2818.pdf
R10 R12 = RES 100 OHM 1% 1/10W 0603: 100 Ohm ±1% 0.1W, 1/10W Chip Resistor 0603 (1608 Metric) Moisture Resistant Thick Film; Manufacturer 1: Yageo; Manufacturer Part Number 1: RC0603FR-07100RL; Temperature Coefficient: ±100ppm/°C; Supplier 1: Digi-Key; Supplier Part Number 1: 311-100HRCT-ND; Packaging: Cut Tape (CT); Part Status: Active; Composition: Thick Film; Operating Temperature: -55°C ~ 155°C; Package / Case: 0603 (1608 Metric); Supplier Device Package: 0603; Size / Dimension: 0.063" L x 0.031" W (1.60mm x 0.80mm); Height - Seated (Max): 0.022" (0.55mm); Failure Rate: -; ComponentLink1URL: http://www.yageo.com/documents/recent/PYu-RC_Group_51_RoHS_L_7.pdf; ComponentLink1Description: http://www.yageo.com/documents/recent/PYu-RC_Group_51_RoHS_L_7.pdf; Tolerance: ±1%
R11 = RES 470K OHM 1% 1/4W 0603: RES SMD 470K OHM 1% 1/4W 0603; Manufacturer 1: Panasonic Electronic Components; Manufacturer Part Number 1: ERJ-PA3F4703V; Temperature Coefficient: ±100ppm/°C; Supplier 1: Digi-Key; Supplier Part Number 1: P470KBYCT-ND; Packaging: Cut Tape (CT); Part Status: Active; Composition: Thick Film; Operating Temperature: -55°C ~ 155°C; Package / Case: 0603 (1608 Metric); Supplier Device Package: 0603; Size / Dimension: 0.063" L x 0.031" W (1.60mm x 0.80mm); Height - Seated (Max): 0.022" (0.55mm); Failure Rate: -; ComponentLink1URL: https://industrial.panasonic.com/cdbs/www-data/pdf/RDO0000/AOA0000C291.pdf; ComponentLink1Description: https://industrial.panasonic.com/cdbs/www-data/pdf/RDO0000/AOA0000C291.pdf
R13 = RES 100K OHM 5% 1/8W 0603: RES SMD 100K OHM 5% 1/10W 0603; Manufacturer 1: Yageo; Manufacturer Part Number 1: RC0603JR-07100KL; Temperature Coefficient: ±100ppm/°C; Supplier 1: Digi-Key; Supplier Part Number 1: 311-100KGRCT-ND; Packaging: Cut Tape (CT); Part Status: Active; Composition: Thick Film; Operating Temperature: -55°C ~ 155°C; Package / Case: 0603 (1608 Metric); Supplier Device Package: 0603; Size / Dimension: 0.063" L x 0.031" W (1.60mm x 0.80mm); Height - Seated (Max): 0.022" (0.55mm); Failure Rate: -; ComponentLink1URL: http://www.yageo.com/documents/recent/PYu-RC_Group_51_RoHS_L_7.pdf; ComponentLink1Description: http://www.yageo.com/documents/recent/PYu-RC_Group_51_RoHS_L_7.pdf; Tolerance: ±5%
R14 = RES 10K OHM 1% 1/10W 0603: as R17 on sheet Power Distribution - Power Path; Supplier 1: Digi-Key; Supplier Part Number 1: 311-10.0KHRCT-ND; Packaging: Cut Tape (CT); Part Status: Active; Composition: Thick Film; Operating Temperature: -55°C ~ 155°C; Package / Case: 0603 (1608 Metric); Supplier Device Package: 0603; Size / Dimension: 0.063" L x 0.031" W (1.60mm x 0.80mm); Height - Seated (Max): 0.022" (0.55mm); Failure Rate: -; ComponentLink1URL: http://www.yageo.com/documents/recent/PYu-RC_Group_51_RoHS_L_7.pdf; ComponentLink1Description: http://www.yageo.com/documents/recent/PYu-RC_Group_51_RoHS_L_7.pdf; Tolerance: ±1%
TP4 = Test Point 0603 SMD: as TP6 on sheet Power Distribution - Power Path; Supplier 1: Digi-Key; Supplier Part Number 1: A106145CT-ND; Stock 1: 212628; Pricing 1: 1=0.22, 10=0.211, 25=0.18, 50=0.1574, 100=0.1462, 250=0.12932, 500=0.12368, 1000=0.1012 (USD); Mount: Surface Mount; Case/Package: 0603; Colour: Natural; Case Code (Imperial): 0603; Case Code (Metric): 1608; Min Operating Temperature: -55°C; Max Operating Temperature: 125°C; Packaging: Tape and Reel; Termination: SMD/SMT; Package Quantity: 2000; Military Standard: Not; Length: 1.6mm; Height: 1.15mm; Width: 0.8mm; Depth: 0.8mm; Radiation Hardening: No; ComponentLink1URL: https://datasheet.ciiva.com/30100/1773266-a-30100967.pdf; ComponentLink1Description: https://datasheet.ciiva.com/30100/1773266-a-30100967.pdf; ComponentLink2URL: https://datasheet.ciiva.com/8914/eng-ds-1773266-a-8914634.pdf; ComponentLink2Description: https://datasheet.ciiva.com/8914/eng-ds-1773266-a-8914634.pdf; ComponentLink3URL: https://datasheet.ciiva.com/6439/eng-ds-1773266-a-6439163.pdf; ComponentLink3Description: https://datasheet.ciiva.com/6439/eng-ds-1773266-a-6439163.pdf; ComponentLink4URL: https://datasheet.ciiva.com/6439/eng-ds-1773266-a-6439164.pdf; ComponentLink4Description: https://datasheet.ciiva.com/6439/eng-ds-1773266-a-6439164.pdf; ComponentLink5URL: https://datasheet.ciiva.com/6439/eng-ds-1773266-a-6439165.pdf; ComponentLink5Description: https://datasheet.ciiva.com/6439/eng-ds-1773266-a-6439165.pdf
U4 = IC CURRENT AMPLIFIER INA240A1 20V/V 8-TSSOP: Current Sense Amplifier 1 Circuit 8-TSSOP; Manufacturer 1: Texas Instruments; ComponentLink1URL: http://www.ti.com/lit/ds/symlink/ina240.pdf; ComponentLink1Description: http://www.ti.com/lit/ds/symlink/ina240.pdf; Supplier 1: Digi-Key; Supplier Part Number 1: 296-45088-1-ND; Stock 1: 4306; Pricing 1: 1=2.65, 10=2.377, 100=1.9109, 500=1.56998, 1000=1.30084 (USD); Case/Package: TSSOP; Min Operating Temperature: -40°C; Max Operating Temperature: 125°C; Lead Free: Lead Free
U5 = IC OP AMP GEN PURPOSE RR 10MHZ SOT-23-5: General Purpose Amplifier 1 Circuit Rail-to-Rail SOT-23-5; Manufacturer 1: Texas Instruments; Manufacturer Part Number 1: TLV316QDBVRQ1; Description 1: IC OP AMP GP RR 10MHZ 5-SOT-23; Number of Circuits: 1; Slew Rate: 6 V/µs; Current - Supply: 400µA; Current - Output / Channel: 50mA; Voltage - Supply, Single/Dual (±): 1.8 V ~ 5.5 V, ±0.9 V ~ 2.75 V; Supplier 1: Digi-Key; Supplier Part Number 1: 296-45323-1-ND; RoHS: RoHS Compliant; Category: Integrated Circuits (ICs); Stock 1: 1747; Pricing 1: 1=1.33, 10=1.185, 100=0.9234, 500=0.76276, 1000=0.60218 (CAD); Packaging: Cut Tape (CT); Part Status: Active; Amplifier Type: General Purpose; Output Type: Rail-to-Rail; -3db Bandwidth: -; Operating Temperature: -40°C ~ 125°C; Mounting Type: Surface Mount; Package / Case: SC-74A, SOT-753; Supplier Device Package: SOT-23-5; ComponentLink1URL: http://www.ti.com/lit/ds/symlink/tlv316-q1.pdf; ComponentLink1Description: http://www.ti.com/lit/ds/symlink/tlv316-q1.pdf